# Altium project SensWear-V1R2-Debug.PrjPcb (part 2 of 3)
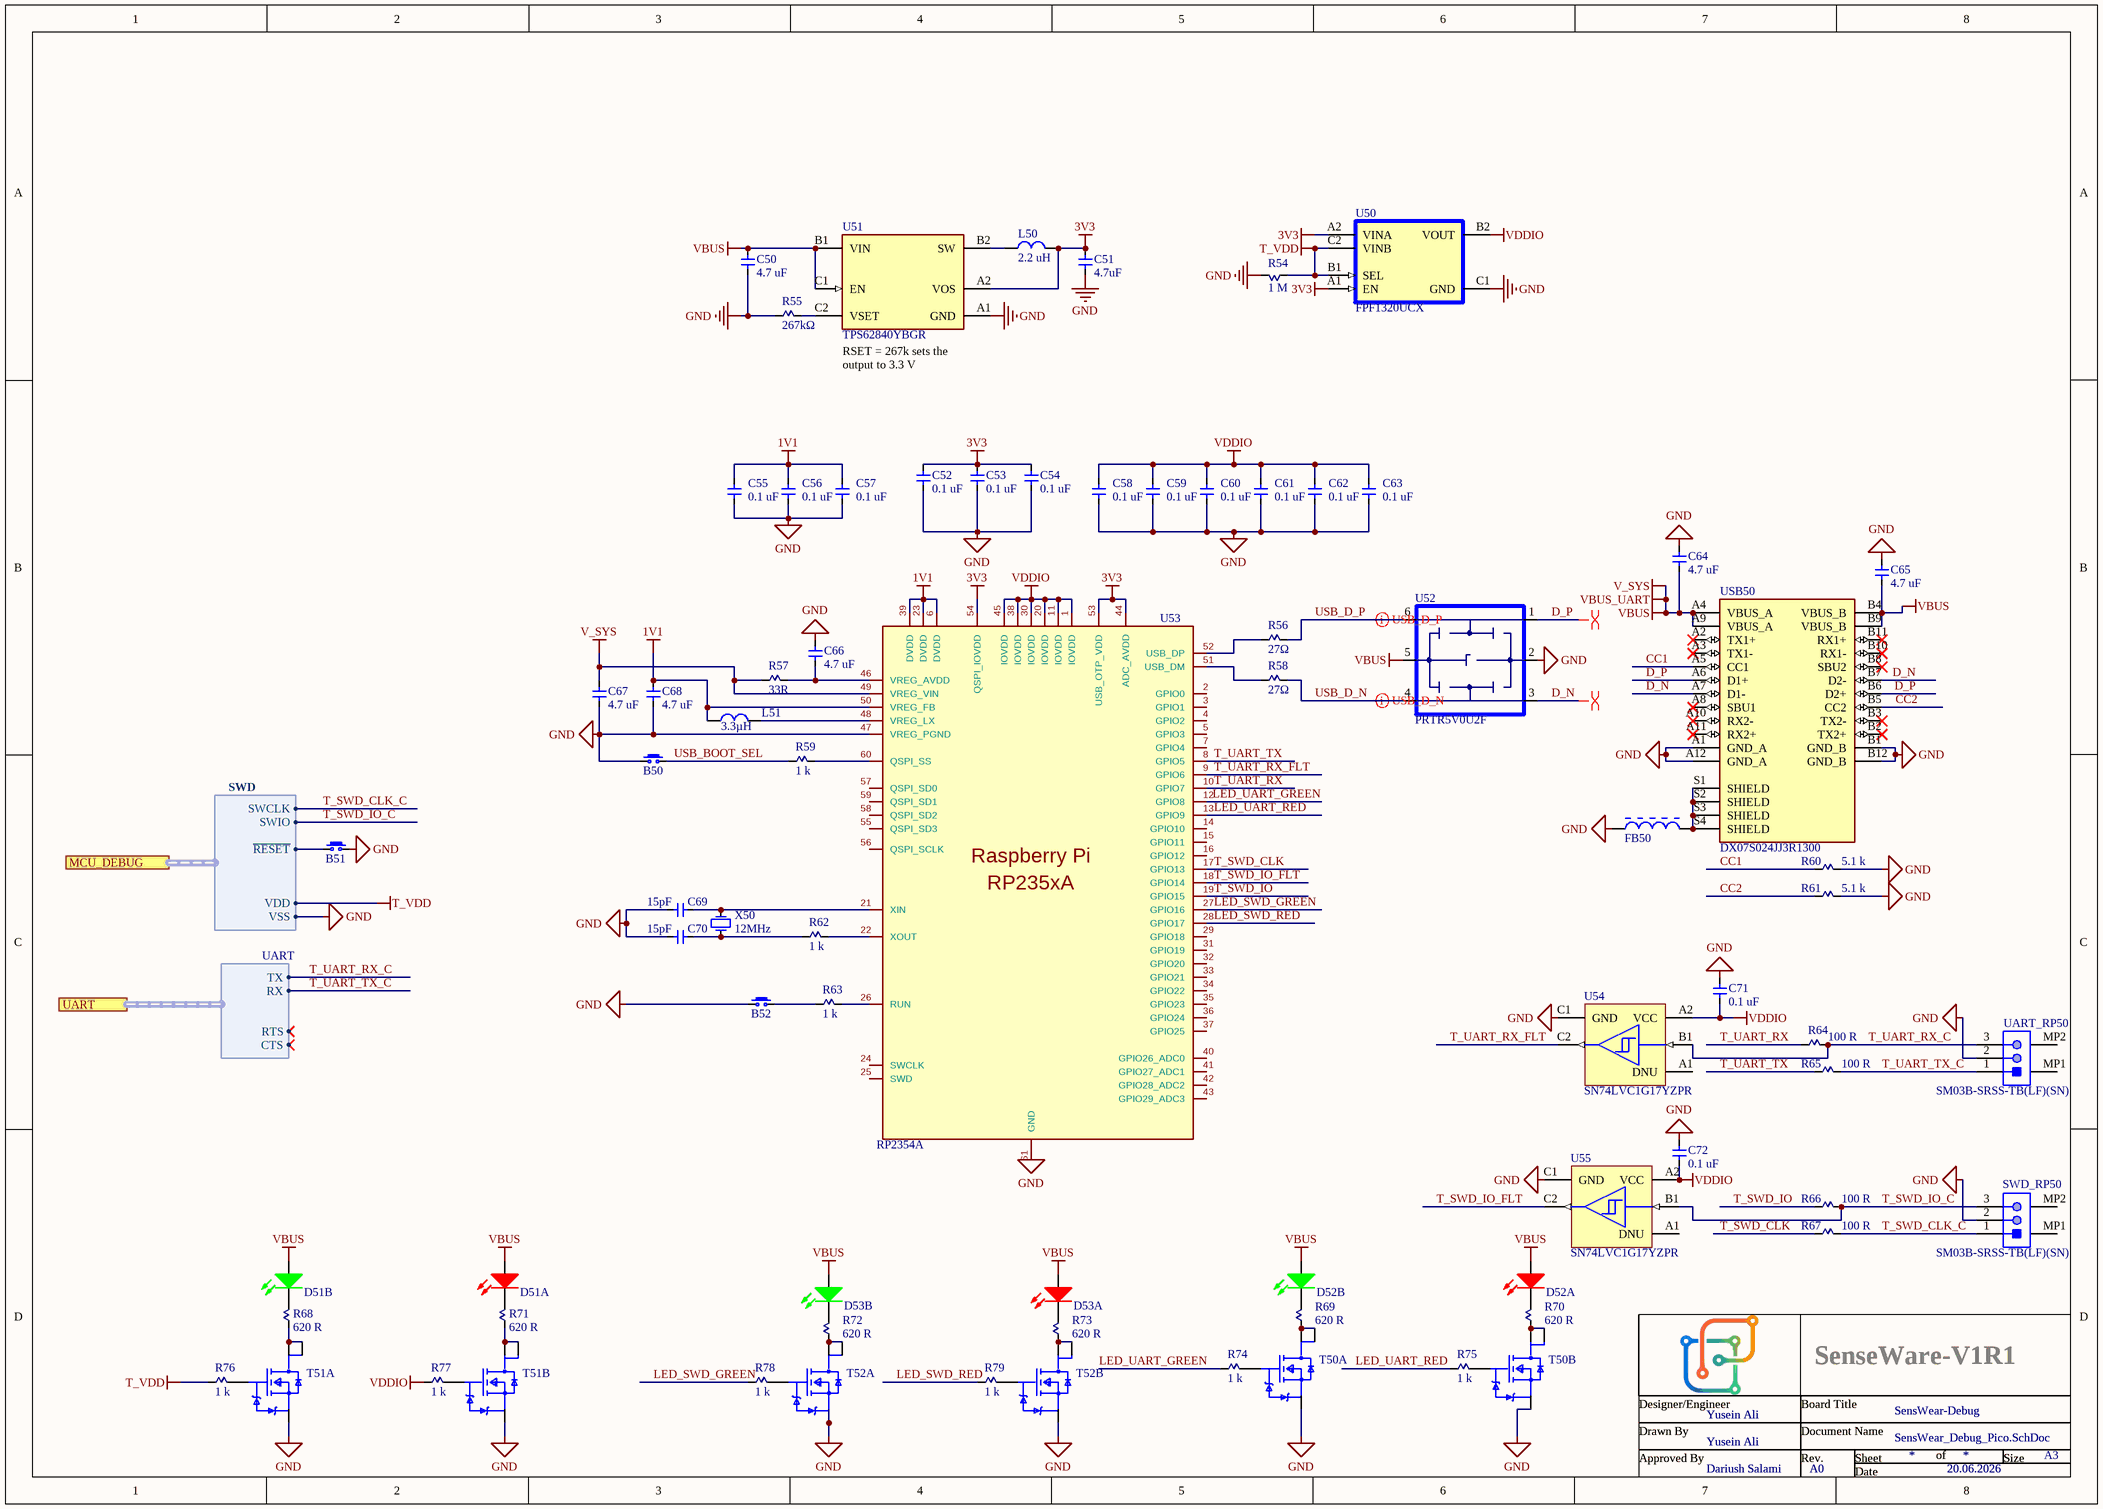
[diagram p3: SensWear_Debug_Pico.SchDoc]

## Sheet SensWear_Debug_Pico.SchDoc (continued)
### Library data of the parts
B50-B52 = B3U-1000P: SWITCH TACTILE SPST-NO 0.05A 12V; Manufacturer: Omron Electronics Inc-EMC Div; Switch Function: Off-Mom; Contact Rating @ Voltage: 0.05A @ 12VDC; Actuator Type: Standard; Actuator Height off PCB, from Pins: 1.60mm; Actuator Orientation: Top Actuated; Outline: 3.00mm x 2.50mm; Illumination: Non-Illuminated; Operating Force: 153gf; Ingress Protection: Dust Proof; Switch Travel: 0.15mm; Mechanical Life: 200,000 Cycles; Supplier 1: Digi-Key; Manufacturer Part Number: B3U-1000P; RoHS: RoHS Compliant; Category: Switches; Stock 1: 66079; Pricing 1: 1=0.93, 10=0.898, 25=0.8468, 50=0.745, 100=0.6774, 250=0.64348, 500=0.62656, 1000=0.49108 (GBP); Packaging: Digi-Reel®; Part Status: Active; Circuit: SPST-NO; Mounting Type: Surface Mount; Termination Style: SMD (SMT) Tab; Illumination Voltage (Nominal): -; Illumination Type, Color: -; Features: -; Actuator Material: -; Operating Temperature: -25°C ~ 70°C; ComponentLink1URL: http://www.omron.com/ecb/products/pdf/en-b3u.pdf; ComponentLink1Description: http://www.omron.com/ecb/products/pdf/en-b3u.pdf; Supplier Part Number 1: SW1020DKR-ND
C50 C64 C65 = GRM188R61A475KE15D: CAP CER 4.7UF 10V X5R 0603; Manufacturer: Murata Electronics North America; Tolerance: ±10%; Capacitance: 4.7µF; Manufacturer Part Number: GRM188R61A475KE15D; RoHS: RoHS Compliant; Category: Capacitors; Packaging: Digi-Reel®; Value: 4.7 uF; ComponentLink1URL: http://www.murata.com/~/media/webrenewal/support/library/catalog/products/capacitor/mlcc/c02e.pdf; ComponentLink1Description: http://www.murata.com/~/media/webrenewal/support/library/catalog/products/capacitor/mlcc/c02e.pdf; Supplier 1: Digi-Key; Supplier Part Number 1: 490-10477-6-ND; Stock 1: 101035; Pricing 1: 1=0.1, 10=0.068, 50=0.0392, 100=0.0323, 250=0.0272, 500=0.0228, 1000=0.0187 (GBP); Part Status: Active; Voltage - Rated: 10V; Temperature Coefficient: X5R; Mounting Type: Surface Mount, MLCC; Operating Temperature: -55°C ~ 85°C; Applications: General Purpose; Ratings: -; Package / Case: 0603 (1608 Metric); Size / Dimension: 0.063" L x 0.031" W (1.60mm x 0.80mm); Height - Seated (Max): -; Thickness (Max): 0.039" (1.00mm); Lead Spacing: -; Features: Derating Recommended; Lead Style: -
C51 = GRM155R61A475MEAAD: Multilayer Ceramic Capacitor, 4.7 uF, 10 V, ± 20%, X5R, 0402 [1005 Metric]; Manufacturer: Murata; Voltage Rating: 10V; Dielectric: 1537DielectricType; Material: 4241ConductorMaterial; Manufacturer Part Number: GRM155R61A475MEAAD; RoHS: Yes; Category: Ceramic Capacitors; Stock: 930000; Pricing: 10000=0,0187, 50000=0,0159, 100000=0,0132 (USD); Mounting Technology: Surface Mount; Case/Package: 0402; Case Code (Metric): 1005; Case Code (Imperial): 0402; Min Operating Temperature: -55°C; Max Operating Temperature: 85°C; Packaging: Tape and Reel; Value: 4.7uF; Tolerance: 20%; Series: GRM; Length: 1mm; Width: 500um; Thickness: 500um; RoHS Compliant: Yes; ComponentLink1URL: http://www.farnell.com/datasheets/2189109.pdf?src-supplier=Farnell; ComponentLink1Description: http://www.farnell.com/datasheets/2189109.pdf?src-supplier=Farnell; ComponentLink2URL: http://www.farnell.com/datasheets/2189109.pdf?src-supplier=Newark; ComponentLink2Description: http://www.farnell.com/datasheets/2189109.pdf?src-supplier=Newark; Supplier 1: Mouser; Supplier Part Number 1: 81-GRM155R61A475MEAD; Supplier 2: Farnell; Supplier Part Number 2: 3581674; Voltage Rating (DC): 10V; Height: 650um; ComponentLink3URL: http://www.farnell.com/datasheets/2189109.pdf?src-supplier=Element14; ComponentLink3Description: http://www.farnell.com/datasheets/2189109.pdf?src-supplier=Element14; ComponentLink4URL: http://datasheet.octopart.com/GRM155R61A475MEAAD-Murata-datasheet-68589269.pdf?src-supplier=Distrelec; ComponentLink4Description: http://datasheet.octopart.com/GRM155R61A475MEAAD-Murata-datasheet-68589269.pdf?src-supplier=Distrelec; ComponentLink5URL: http://datasheet.octopart.com/GRM155R61A475MEAAD-Murata-datasheet-68589269.pdf?src-supplier=Farnell; ComponentLink5Description: http://datasheet.octopart.com/GRM155R61A475MEAAD-Murata-datasheet-68589269.pdf?src-supplier=Farnell; ComponentLink6URL: https://search.murata.co.jp/Ceramy/image/img/A01X/G101/ENG/GRM155R61A475MEAA-01.pdf?src-supplier=Digi-Key; ComponentLink6Description: https://search.murata.co.jp/Ceramy/image/img/A01X/G101/ENG/GRM155R61A475MEAA-01.pdf?src-supplier=Digi-Key; ComponentLink7URL: http://datasheet.octopart.com/GRM155R61A475MEAAD-Murata-datasheet-68589269.pdf?src-supplier=Future+Electronics; ComponentLink7Description: http://datasheet.octopart.com/GRM155R61A475MEAAD-Murata-datasheet-68589269.pdf?src-supplier=Future+Electronics; ComponentLink8URL: https://datasheet.octopart.com/GRM155R61A475MEAAD-Murata-datasheet-68589269.pdf?src-supplier=Newark; ComponentLink8Description: https://datasheet.octopart.com/GRM155R61A475MEAAD-Murata-datasheet-68589269.pdf?src-supplier=Newark; ComponentLink9URL: http://datasheet.octopart.com/GRM155R61A475MEAAD-Murata-datasheet-68589269.pdf?src-supplier=Verical; ComponentLink9Description: http://datasheet.octopart.com/GRM155R61A475MEAAD-Murata-datasheet-68589269.pdf?src-supplier=Verical; ComponentLink10URL: https://datasheet.octopart.com/GRM155R61A475MEAAD-Murata-datasheet-165579666.pdf?src-supplier=TME; ComponentLink10Description: https://datasheet.octopart.com/GRM155R61A475MEAAD-Murata-datasheet-165579666.pdf?src-supplier=TME; ComponentLink11URL: http://datasheet.octopart.com/GRM155R61A475MEAAD-Murata-datasheet-68589269.pdf?src-supplier=Quest; ComponentLink11Description: http://datasheet.octopart.com/GRM155R61A475MEAAD-Murata-datasheet-68589269.pdf?src-supplier=Quest; ComponentLink12URL: http://datasheet.octopart.com/GRM155R61A475MEAAD-Murata-datasheet-68589269.pdf?src-supplier=TTI; ComponentLink12Description: http://datasheet.octopart.com/GRM155R61A475MEAAD-Murata-datasheet-68589269.pdf?src-supplier=TTI; ComponentLink13URL: http://datasheet.octopart.com/GRM155R61A475MEAAD-Murata-datasheet-68589269.pdf?src-supplier=NAC+Semi; ComponentLink13Description: http://datasheet.octopart.com/GRM155R61A475MEAAD-Murata-datasheet-68589269.pdf?src-supplier=NAC+Semi
C52-C63 C71 C72 = GRM155R61A104KA01D: CAP CER 0.1UF 10V X5R 0402; Manufacturer: Murata Electronics North America; Capacitance: 0.10µF; Tolerance: ±10%; Supplier 1: Digi-Key; Manufacturer Part Number: GRM155R61A104KA01D; RoHS: RoHS Compliant; Category: Capacitors; Stock 1: 7731132; Pricing 1: 1=0.1, 10=0.012, 50=0.0066, 100=0.0055, 250=0.00452, 500=0.00386, 1000=0.003, 5000=0.0025 (USD); Packaging: Digi-Reel®; Part Status: Active; Voltage - Rated: 10V; Temperature Coefficient: X5R; Operating Temperature: -55°C ~ 85°C; Features: -; Ratings: -; Applications: General Purpose; Mounting Type: Surface Mount, MLCC; Package / Case: 0402 (1005 Metric); Size / Dimension: 0.039" L x 0.020" W (1.00mm x 0.50mm); Height - Seated (Max): -; Thickness (Max): 0.022" (0.55mm); Lead Spacing: -; Lead Style: -; ComponentLink1URL: http://www.murata.com/~/media/webrenewal/support/library/catalog/products/capacitor/mlcc/c02e.ashx; ComponentLink1Description: http://www.murata.com/~/media/webrenewal/support/library/catalog/products/capacitor/mlcc/c02e.ashx; Supplier Part Number 1: 490-1318-6-ND; Value: 0.1 uF
C66-C68 = GRM188R61A475KE15D: CAP CER 4.7UF 10V X5R 0603; Manufacturer: Murata Electronics North America; Capacitance: 4.7µF; Tolerance: ±10%; Supplier 1: Digi-Key; Manufacturer Part Number: GRM188R61A475KE15D; RoHS: RoHS Compliant; Category: Capacitors; Stock 1: 101035; Pricing 1: 1=0.1, 10=0.068, 50=0.0392, 100=0.0323, 250=0.0272, 500=0.0228, 1000=0.0187 (GBP); Packaging: Digi-Reel®; Part Status: Active; Voltage - Rated: 10V; Temperature Coefficient: X5R; Mounting Type: Surface Mount, MLCC; Operating Temperature: -55°C ~ 85°C; Applications: General Purpose; Ratings: -; Package / Case: 0603 (1608 Metric); Size / Dimension: 0.063" L x 0.031" W (1.60mm x 0.80mm); Height - Seated (Max): -; Thickness (Max): 0.039" (1.00mm); Lead Spacing: -; Features: Derating Recommended; Lead Style: -; ComponentLink1URL: http://www.murata.com/~/media/webrenewal/support/library/catalog/products/capacitor/mlcc/c02e.pdf; ComponentLink1Description: http://www.murata.com/~/media/webrenewal/support/library/catalog/products/capacitor/mlcc/c02e.pdf; Supplier Part Number 1: 490-10477-6-ND; Value: 4.7 uF
C69 C70 = GRM1555C1E150JA01D: CAP CER 15 pF 25V C0G 0402; Manufacturer: Murata; Manufacturer Lifecycle Status: NRND; Dielectric Material: Ceramic; Tolerance: 5%; Supplier: Future Electronics; Supplier Part Number: GRM1555C1E150JA01D; Manufacturer Part Number: GRM1555C1E150JA01D; RoHS: Compliant; Category: Ceramic Capacitors; Stock: 110000; Pricing: 10000=0.0053, 30000=0.0051, 50000=0.005, 150000=0.0049, 250000=0.0047 (USD); Value: 15pF; Case/Package: 0402; Case Code (Imperial): 0402; Case Code (Metric): 1005; Depth: 500µm; Dielectric: C0G; Height: 500µm; Lead Free: Lead Free; Length: 1mm; Lifecycle Status: NRND; Material: Ceramic; Max Operating Temperature: 125°C; Min Operating Temperature: -55°C; Mounting Technology: Surface Mount; Number of Terminals: 2; Radiation Hardening: No; REACH SVHC: Yes; Schedule B: 8532240020, 8532240020|8532240020, 8532240020|8532240020|8532240020, 8532240020|8532240020|8532240020|8532240020; Termination: SMD/SMT; Thickness: 500µm; Voltage Rating: 25V; Voltage Rating (DC): 25V; Width: 500µm; ComponentLink1URL: https://datasheet.octopart.com:443/GRM1555C1E150JA01D-Murata-datasheet-14399184.pdf?src-supplier=Future+Electronics; ComponentLink1Description: https://datasheet.octopart.com:443/GRM1555C1E150JA01D-Murata-datasheet-14399184.pdf?src-supplier=Future+Electronics; ComponentLink2URL: https://datasheet.octopart.com:443/GRM1555C1E150JA01D-Murata-datasheet-22122223.pdf?src-supplier=Future+Electronics; ComponentLink2Description: https://datasheet.octopart.com:443/GRM1555C1E150JA01D-Murata-datasheet-22122223.pdf?src-supplier=Future+Electronics; ComponentLink3URL: https://datasheet.octopart.com:443/GRM1555C1E150JA01D-Murata-datasheet-141274211.pdf?src-supplier=Ciiva; ComponentLink3Description: https://datasheet.octopart.com:443/GRM1555C1E150JA01D-Murata-datasheet-141274211.pdf?src-supplier=Ciiva; ComponentLink4URL: https://datasheet.octopart.com:443/GRM1555C1E150JA01D-Murata-datasheet-140679615.pdf?src-supplier=Ciiva; ComponentLink4Description: https://datasheet.octopart.com:443/GRM1555C1E150JA01D-Murata-datasheet-140679615.pdf?src-supplier=Ciiva; ComponentLink5URL: https://datasheet.octopart.com:443/GRM1555C1E150JA01D-Murata-datasheet-138739066.pdf?src-supplier=Ciiva; ComponentLink5Description: https://datasheet.octopart.com:443/GRM1555C1E150JA01D-Murata-datasheet-138739066.pdf?src-supplier=Ciiva; ComponentLink6URL: https://datasheet.octopart.com/GRM1555C1E150JA01D-Murata-datasheet-12515295.pdf; ComponentLink6Description: https://datasheet.octopart.com/GRM1555C1E150JA01D-Murata-datasheet-12515295.pdf; ComponentLink7URL: https://datasheet.octopart.com/GRM1555C1E150JA01D-Murata-datasheet-12510076.pdf; ComponentLink7Description: https://datasheet.octopart.com/GRM1555C1E150JA01D-Murata-datasheet-12510076.pdf; ComponentLink8URL: https://datasheet.octopart.com/GRM1555C1E150JA01D-Murata-datasheet-11978611.pdf; ComponentLink8Description: https://datasheet.octopart.com/GRM1555C1E150JA01D-Murata-datasheet-11978611.pdf; ComponentLink9URL: https://datasheet.octopart.com/GRM1555C1E150JA01D-Murata-datasheet-10025737.pdf; ComponentLink9Description: https://datasheet.octopart.com/GRM1555C1E150JA01D-Murata-datasheet-10025737.pdf; ComponentLink10URL: https://datasheet.octopart.com/GRM1555C1E150JA01D-Murata-datasheet-8819587.pdf; ComponentLink10Description: https://datasheet.octopart.com/GRM1555C1E150JA01D-Murata-datasheet-8819587.pdf; ComponentLink11URL: http://sigma.octopart.com:80/reach_statement/Murata-company-16.pdf?src-supplier=Compliance+Statements; ComponentLink11Description: http://sigma.octopart.com:80/reach_statement/Murata-company-16.pdf?src-supplier=Compliance+Statements
D51-D53 = LTST-C155KGJRKT: LED GREEN/RED CLEAR CHIP SMD; Manufacturer: Vishay Lite-On; Color: Green,Red; Lens Color: Colorless; Viewing Angle: 130°; Reverse Voltage: 5V; Wavelength: 639nm; Number of LEDs: 2; Forward Current: 30mA; Forward Voltage: 2V; Power Rating: 75mW; Luminous Intensity: 45mcd; Lens Style: Diffused,Colorless,Rectangular,Clear; Dominant Wavelength: 631nm; Test Current: 20mA; Supplier 1: Digi-Key; Manufacturer Part Number: LTST-C155KGJRKT; RoHS: Yes; Category: LEDs; Stock 1: 123598; Pricing 1: 1=0.43000, 10=0.28000, 100=0.18670, 500=0.12912, 1000=0.10760 (USD); Packaging: Tape and Reel; Lens Transparency: Clear; ComponentLink1URL: https://datasheet.ciiva.com/11774/0900766b80dc0273-11774195.pdf?src-supplier=RSComponents; ComponentLink1Description: https://datasheet.ciiva.com/11774/0900766b80dc0273-11774195.pdf?src-supplier=RSComponents; Supplier Part Number 1: 160-1409-1-ND; Mount: Surface Mount; Case/Package: 1210; Number of Pins: 4; Case Code (Imperial): 1210; Case Code (Metric): 3225; Min Operating Temperature: -55°C; Max Operating Temperature: 85°C; Package Quantity: 1; Illumination Color: Green,Red; Number of Elements: 2; Power Dissipation: 75mW; Max Power Dissipation: 75mW; Length: 2.7mm; Width: 2.7mm; Height: 1.1mm; Depth: 3.2mm; Radiation Hardening: No; Lead Free: Lead Free; ComponentLink2URL: https://datasheet.ciiva.com/15117/getdatasheetpartid-103641-15117440.pdf?src-supplier=Verical; ComponentLink2Description: https://datasheet.ciiva.com/15117/getdatasheetpartid-103641-15117440.pdf?src-supplier=Verical; ComponentLink3URL: https://datasheet.ciiva.com/16366/lite-on20ltst-c155kgjrkt-16366147.pdf?src-supplier=Future+Electronics; ComponentLink3Description: https://datasheet.ciiva.com/16366/lite-on20ltst-c155kgjrkt-16366147.pdf?src-supplier=Future+Electronics; ComponentLink4URL: https://datasheet.ciiva.com/27051/1260277-27051786.pdf?src-supplier=Jameco; ComponentLink4Description: https://datasheet.ciiva.com/27051/1260277-27051786.pdf?src-supplier=Jameco; ComponentLink5URL: https://datasheet.ciiva.com/2110/s-110-ltst-c155kgjrkt-2110800.pdf?src-supplier=Digi-Key; ComponentLink5Description: https://datasheet.ciiva.com/2110/s-110-ltst-c155kgjrkt-2110800.pdf?src-supplier=Digi-Key; ComponentLink6URL: https://datasheet.ciiva.com/2110/s-110-ltst-c155kgjrkt-2110801.pdf?src-supplier=Digi-Key; ComponentLink6Description: https://datasheet.ciiva.com/2110/s-110-ltst-c155kgjrkt-2110801.pdf?src-supplier=Digi-Key
FB50 = BLM15AG601SN1D: FERRITE BEAD 600 OHM 0402 1LN; Manufacturer: Murata; Material: Steel,Ferrite; Max DC Current: 300mA; DC Resistance (DCR): 520mR; Impedance: 600R; Test Frequency: 100MHz; Number of Lines: 1; Tolerance: 25%; Shielding: Unshielded; Supplier 1: Digi-Key; Supplier Part Number 1: 490-1006-1-ND; Manufacturer Part Number: BLM15AG601SN1D; RoHS: Yes; Category: Inductors; Stock 1: 436370; Pricing 1: 1=0.10000, 10=0.07600, 25=0.06960, 50=0.06260, 100=0.04590, 250=0.03336, 500=0.03058, 1000=0.02641, 5000=0.02085 (USD); Case/Package: 0402; Number of Pins: 2; Case Code (Metric): 1005; Case Code (Imperial): 0402; Core Material: Ferrite; Min Operating Temperature: -55°C; Max Operating Temperature: 125°C; Package Quantity: 10000; Packaging: Tape and Reel; Current Rating: 300mA; Termination: SMD/SMT; Max Current Rating: 300mA; Number of Circuits: 1; DC Current: 300mA; Frequency: 100MHz; Length: 1mm; Width: 0.5mm; Height: 0.5mm; Depth: 0.55mm; Radiation Hardening: No; REACH SVHC: No SVHC; Lead Free: Lead Free; Military Standard: Not; ComponentLink1URL: https://datasheet.ciiva.com/11799/0900766b811b5866-11799226.pdf?src-supplier=RSComponents; ComponentLink1Description: https://datasheet.ciiva.com/11799/0900766b811b5866-11799226.pdf?src-supplier=RSComponents; ComponentLink2URL: https://datasheet.ciiva.com/29347/442210-da-01-en-chip-drossel-0402-600r-300ma-1-0x0-5mm-29347879.pdf?src-supplier=Conrad; ComponentLink2Description: https://datasheet.ciiva.com/29347/442210-da-01-en-chip-drossel-0402-600r-300ma-1-0x0-5mm-29347879.pdf?src-supplier=Conrad; ComponentLink3URL: https://datasheet.ciiva.com/41449/001172163-da-01-en-drossel-0402-600r-1-0x0-5mm-10000st-41449450.pdf?src-supplier=Conrad; ComponentLink3Description: https://datasheet.ciiva.com/41449/001172163-da-01-en-drossel-0402-600r-1-0x0-5mm-10000st-41449450.pdf?src-supplier=Conrad; ComponentLink4URL: https://datasheet.ciiva.com/6212/l0110s0100blm15ag-sn-6212565.pdf?src-supplier=Digi-Key; ComponentLink4Description: https://datasheet.ciiva.com/6212/l0110s0100blm15ag-sn-6212565.pdf?src-supplier=Digi-Key; ComponentLink5URL: https://datasheet.ciiva.com/6212/l0110s0100blm15ag-sn-6212519.pdf?src-supplier=Digi-Key; ComponentLink5Description: https://datasheet.ciiva.com/6212/l0110s0100blm15ag-sn-6212519.pdf?src-supplier=Digi-Key; ComponentLink6URL: https://datasheet.ciiva.com/1466/5144-1466744.pdf?src-supplier=Element14; ComponentLink6Description: https://datasheet.ciiva.com/1466/5144-1466744.pdf?src-supplier=Element14; ComponentLink7URL: https://datasheet.ciiva.com/6212/l0110s0100blm15ag-sn-6212520.pdf?src-supplier=Digi-Key; ComponentLink7Description: https://datasheet.ciiva.com/6212/l0110s0100blm15ag-sn-6212520.pdf?src-supplier=Digi-Key; ComponentLink8URL: https://datasheet.ciiva.com/1466/5144-1466745.pdf?src-supplier=Element14; ComponentLink8Description: https://datasheet.ciiva.com/1466/5144-1466745.pdf?src-supplier=Element14; ComponentLink9URL: https://datasheet.ciiva.com/8510/l0110s0100blm15ag-sn-8510909.pdf?src-supplier=Avnet; ComponentLink9Description: https://datasheet.ciiva.com/8510/l0110s0100blm15ag-sn-8510909.pdf?src-supplier=Avnet; ComponentLink10URL: https://datasheet.ciiva.com/14122/blm-series-eng-tds-14122894.pdf?src-supplier=Distrelec; ComponentLink10Description: https://datasheet.ciiva.com/14122/blm-series-eng-tds-14122894.pdf?src-supplier=Distrelec; ComponentLink11URL: https://datasheet.ciiva.com/8084/l0110s0100blm15ag-sn-8084271.pdf?src-supplier=Avnet; ComponentLink11Description: https://datasheet.ciiva.com/8084/l0110s0100blm15ag-sn-8084271.pdf?src-supplier=Avnet
L50 = DFE201612E-2R2M=P2: Inductor Power Shielded Wirewound 2.2uH 20% 1MHz Metal 1.8A 0.116Ohm DCR 0806 T/R; Manufacturer: Murata; Saturation Current: 2.4A; ESR: 116mR; Supplier: Mouser; Supplier Part Number: 81-DFE201612E-2R2MP2; Manufacturer Part Number: DFE201612E-2R2M=P2; RoHS: Yes; Category: Fixed Inductors; Stock: 102000; Pricing: 3000=0,0929 (USD); ComponentLink1URL: http://www.farnell.com/datasheets/2339714.pdf?src-supplier=Farnell; ComponentLink1Description: http://www.farnell.com/datasheets/2339714.pdf?src-supplier=Farnell; ComponentLink2URL: https://search.murata.co.jp/Ceramy/image/img/P02/J(E)TE243A-0006.pdf?src-supplier=Digi-Key; ComponentLink2Description: https://search.murata.co.jp/Ceramy/image/img/P02/J(E)TE243A-0006.pdf?src-supplier=Digi-Key; ComponentLink3URL: http://www.farnell.com/datasheets/2339714.pdf?src-supplier=Newark; ComponentLink3Description: http://www.farnell.com/datasheets/2339714.pdf?src-supplier=Newark; ComponentLink4URL: https://datasheet.octopart.com/DFE201612E-2R2M%3DP2-Murata-datasheet-150582460.pdf?src-supplier=Arrow.cn; ComponentLink4Description: https://datasheet.octopart.com/DFE201612E-2R2M%3DP2-Murata-datasheet-150582460.pdf?src-supplier=Arrow.cn; Supplier 1: Mouser; Supplier Part Number 1: 81-DFE201612E-2R2MP2; Value: 2.2 uH; Min Operating Temperature: -40°C; Max Operating Temperature: 125°C; Current Rating: 1.8A; Inductance Tolerance: 20%; Packaging: 13Packaging; RMS Current (Irms): 1.8A; Test Frequency: 1MHz; Height: 1.2mm; ComponentLink5URL: https://search.murata.co.jp/Ceramy/image/img/P02/J(E)TE243A-0006.pdf?src-supplier=Digikey; ComponentLink5Description: https://search.murata.co.jp/Ceramy/image/img/P02/J(E)TE243A-0006.pdf?src-supplier=Digikey; Supplier 2: Digikey; Supplier Part Number 2: 490-DFE201612E-2R2M=P2CT-ND; Supplier 3: Digikey; Supplier Part Number 3: 490-DFE201612E-2R2M=P2DKR-ND
L51 = AOTA-B201610S3R3-101-T: General Purpose Inductor, 3.3uH, 20%, 1 Element, SMD, 0806; Manufacturer: Abracon; DC Resistance (DCR): 140mΩ; Max Current Rating: 2.1A; Number of Circuits: 1; Self Resonant Frequency: 21MHz; Shielding: Shielded; Test Frequency: 1MHz; Supplier: Future Electronics; Supplier Part Number: AOTA-B201610S3R3-101-T; Manufacturer Part Number: AOTA-B201610S3R3-101-T; RoHS: Compliant; Category: Fixed Inductors; Stock: 9000; Pricing: 3000=0.0966, 6000=0.095, 9000=0.094, 12000=0.0933, 15000=0.0911 (USD); Case/Package: 0806; Export Control Classification Number (ECCN) Code: EAR99; Height: 1mm; Harmonized Tariff Schedule (HTS) Code: 8504.50.80.00; Value: 3.3µH; Introduction Date: 2024-09-16; Length: 2mm; Lifecycle Status: Production; Max Operating Temperature: 125°C; Min Operating Temperature: -40°C; Number of Terminals: 2; Tolerance: 20%; Width: 1.6mm; ComponentLink1URL: https://datasheet.octopart.com:443/AOTA-B201610S3R3-101-T-Abracon-datasheet-188850378.pdf?src-supplier=HQonline; ComponentLink1Description: https://datasheet.octopart.com:443/AOTA-B201610S3R3-101-T-Abracon-datasheet-188850378.pdf?src-supplier=HQonline; ComponentLink2URL: http://sigma.octopart.com:80/conflict_mineral_statement/Abracon-company-27.pdf?src-supplier=Compliance+Statements; ComponentLink2Description: http://sigma.octopart.com:80/conflict_mineral_statement/Abracon-company-27.pdf?src-supplier=Compliance+Statements
R54 = ERJ-2RKF1004X: RES SMD 1M OHM 1% 1/10W 0402; Manufacturer: Panasonic Electronic Components; Power (Watts): 0.1W, 1/10W; Temperature Coefficient: ±100ppm/°C; Supplier 1: Digi-Key; Manufacturer Part Number: ERJ-2RKF1004X; RoHS: RoHS Compliant; Category: Resistors; Stock 1: 1590446; Pricing 1: 1=0.1, 10=0.025, 25=0.018, 50=0.0136, 100=0.01, 250=0.00764, 500=0.00612, 1000=0.00451, 5000=0.00323 (USD); Packaging: Digi-Reel®; Part Status: Active; Resistance (Ohms): 1M; Tolerance: ±1%; Composition: Thick Film; Features: Automotive AEC-Q200; Operating Temperature: -55°C ~ 155°C; Package / Case: 0402 (1005 Metric); Supplier Device Package: 0402; Size / Dimension: 0.039" L x 0.020" W (1.00mm x 0.50mm); Height - Seated (Max): 0.016" (0.40mm); Number of Terminations: 2; Failure Rate: -; ComponentLink1URL: https://industrial.panasonic.com/cdbs/www-data/pdf/RDA0000/AOA0000C283.pdf; ComponentLink1Description: https://industrial.panasonic.com/cdbs/www-data/pdf/RDA0000/AOA0000C283.pdf; Supplier Part Number 1: P1.00MLDKR-ND; Value: 1 M
R55 = ERJ-2RKF2673X: Res Thick Film 0402 267K Ohm 1% 1/10W ±100ppm/°C Molded SMD Punched Carrier T/R; Manufacturer: Panasonic; Manufacturer Lifecycle Status: ACTIVE; Part Series: Precision Thick Film Chip Resistors; Max Power Dissipation: 100mW; Voltage Rating: 50V; Supplier: Future Electronics; Supplier Part Number: ERJ2RKF2673X; Manufacturer Part Number: ERJ-2RKF2673X; RoHS: Compliant; Category: Chip SMD Resistors; Stock: 90000; Pricing: 10000=0.0035, 40000=0.0034, 150000=0.0033, 250000=0.0032, 500000=0.0031 (USD); ComponentLink1URL: https://datasheet.octopart.com:443/ERJ-2RKF2673X-Panasonic-datasheet-82288794.pdf?src-supplier=Panasonic; ComponentLink1Description: https://datasheet.octopart.com:443/ERJ-2RKF2673X-Panasonic-datasheet-82288794.pdf?src-supplier=Panasonic; Value: 267kΩ; Case/Package: 0402; Case Code (Imperial): 0402; China RoHS: Non-Compliant; Composition: Thick Film; Contact Plating: Tin; Country of Origin: Japan, Mainland China; Depth: 500µm; Export Control Classification Number (ECCN) Code: EAR99; Features: Automotive AEC-Q200; Height: 350µm; Harmonized Tariff Schedule (HTS) Code: 8533.21.00.30; Introduction Date: 2004-02-02; Lead Free: Lead Free; Length: 1mm; Lifecycle Status: Production; Max Operating Temperature: 155°C; Military Standard: Not; Min Operating Temperature: -55°C; Mounting Technology: Surface Mount; Number of Terminals: 2; Number of Terminations: 2; Power Dissipation: 100mW; Power Rating: 100mW; Ratings: AEC-Q200; REACH SVHC: Yes; Schedule B: 8533210045, 8533210045|8533210045|8533210045|8533210045|8533210045; Temperature Coefficient: 100ppm/°C; Termination: SMD/SMT; Tolerance: 1%; Voltage Rating (DC): 50V; Width: 500µm; Working Voltage: 50V; ComponentLink2URL: https://datasheet.octopart.com:443/ERJ-2RKF2673X-Panasonic-datasheet-48891056.pdf?src-supplier=Newark; ComponentLink2Description: https://datasheet.octopart.com:443/ERJ-2RKF2673X-Panasonic-datasheet-48891056.pdf?src-supplier=Newark; ComponentLink3URL: https://datasheet.octopart.com:443/ERJ-2RKF2673X-Panasonic-datasheet-13266541.pdf?src-supplier=Newark; ComponentLink3Description: https://datasheet.octopart.com:443/ERJ-2RKF2673X-Panasonic-datasheet-13266541.pdf?src-supplier=Newark; ComponentLink4URL: https://datasheet.octopart.com:443/ERJ-2RKF2673X-Panasonic-datasheet-33006990.pdf?src-supplier=Newark; ComponentLink4Description: https://datasheet.octopart.com:443/ERJ-2RKF2673X-Panasonic-datasheet-33006990.pdf?src-supplier=Newark; ComponentLink5URL: https://datasheet.octopart.com:443/ERJ-2RKF2673X-Panasonic---ECG-datasheet-21211697.pdf?src-supplier=Newark; ComponentLink5Description: https://datasheet.octopart.com:443/ERJ-2RKF2673X-Panasonic---ECG-datasheet-21211697.pdf?src-supplier=Newark; ComponentLink6URL: https://datasheet.octopart.com:443/ERJ-2RKF2673X-Panasonic-datasheet-136608610.pdf?src-supplier=Farnell; ComponentLink6Description: https://datasheet.octopart.com:443/ERJ-2RKF2673X-Panasonic-datasheet-136608610.pdf?src-supplier=Farnell; ComponentLink7URL: https://datasheet.octopart.com:443/ERJ-2RKF2673X-Panasonic---ECG-datasheet-15994758.pdf?src-supplier=Farnell; ComponentLink7Description: https://datasheet.octopart.com:443/ERJ-2RKF2673X-Panasonic---ECG-datasheet-15994758.pdf?src-supplier=Farnell; ComponentLink8URL: https://datasheet.octopart.com:443/ERJ-2RKF2673X-Panasonic---ECG-datasheet-10025800.pdf?src-supplier=Farnell; ComponentLink8Description: https://datasheet.octopart.com:443/ERJ-2RKF2673X-Panasonic---ECG-datasheet-10025800.pdf?src-supplier=Farnell; ComponentLink9URL: https://datasheet.octopart.com:443/ERJ-2RKF2673X-Panasonic---ECG-datasheet-8853621.pdf?src-supplier=Farnell; ComponentLink9Description: https://datasheet.octopart.com:443/ERJ-2RKF2673X-Panasonic---ECG-datasheet-8853621.pdf?src-supplier=Farnell; ComponentLink10URL: https://datasheet.octopart.com:443/ERJ-2RKF2673X-Panasonic---ECG-datasheet-5313456.pdf?src-supplier=Farnell; ComponentLink10Description: https://datasheet.octopart.com:443/ERJ-2RKF2673X-Panasonic---ECG-datasheet-5313456.pdf?src-supplier=Farnell; ComponentLink11URL: https://datasheet.octopart.com:443/ERJ2RKF2673X-Panasonic-datasheet-164353789.pdf?src-supplier=HQonline; ComponentLink11Description: https://datasheet.octopart.com:443/ERJ2RKF2673X-Panasonic-datasheet-164353789.pdf?src-supplier=HQonline; ComponentLink12URL: https://datasheet.octopart.com:443/ERJ-2RKF2673X-Panasonic-datasheet-154766169.pdf?src-supplier=Master+Electronics; ComponentLink12Description: https://datasheet.octopart.com:443/ERJ-2RKF2673X-Panasonic-datasheet-154766169.pdf?src-supplier=Master+Electronics; ComponentLink13URL: https://datasheet.octopart.com:443/ERJ2RKF2673X-Panasonic-datasheet-188592431.pdf?src-supplier=TME; ComponentLink13Description: https://datasheet.octopart.com:443/ERJ2RKF2673X-Panasonic-datasheet-188592431.pdf?src-supplier=TME; ComponentLink14URL: https://datasheet.octopart.com/ERJ-2RKF2673X-Panasonic-datasheet-78375410.pdf; ComponentLink14Description: https://datasheet.octopart.com/ERJ-2RKF2673X-Panasonic-datasheet-78375410.pdf; ComponentLink15URL: https://datasheet.octopart.com:443/ERJ-2RKF2673X-Panasonic-datasheet-11542829.pdf?src-supplier=Arrow+Electronics; ComponentLink15Description: https://datasheet.octopart.com:443/ERJ-2RKF2673X-Panasonic-datasheet-11542829.pdf?src-supplier=Arrow+Electronics; ComponentLink16URL: https://datasheet.octopart.com:443/ERJ-2RKF2673X-Panasonic-datasheet-118621.pdf?src-supplier=DigiKey; ComponentLink16Description: https://datasheet.octopart.com:443/ERJ-2RKF2673X-Panasonic-datasheet-118621.pdf?src-supplier=DigiKey; ComponentLink17URL: https://datasheet.octopart.com:443/ERJ-2RKF2673X-Panasonic-datasheet-41391857.pdf?src-supplier=Electro+Sonic; ComponentLink17Description: https://datasheet.octopart.com:443/ERJ-2RKF2673X-Panasonic-datasheet-41391857.pdf?src-supplier=Electro+Sonic
R56 R58 = ERJ-2RKF27R0X: Res Thick Film 0402 27 Ohm 1% 0.1W ±100ppm/°C Molded SMD Punched Carrier T/R; Manufacturer: Panasonic; Manufacturer Lifecycle Status: ACTIVE; Part Series: Precision Thick Film Chip Resistors; Max Power Dissipation: 100mW; Voltage Rating: 50V; Supplier: Farnell; Supplier Part Number: ERJ2RKF27R0X; Manufacturer Part Number: ERJ-2RKF27R0X; RoHS: Compliant; Category: Chip SMD Resistors; Stock: 52991; Pricing: 10=0.0163, 100=0.0124, 500=0.0086, 2500=0.0077, 5000=0.0058 (EUR); Case/Package: 0402; Case Code (Imperial): 0402; Case Code (Metric): 1005; China RoHS: Non-Compliant; Composition: Thick Film; Contact Plating: Tin; Depth: 500µm; Features: Automotive AEC-Q200; Height: 350µm; Lead Free: Lead Free; Length: 1mm; Lifecycle Status: Production; Max Operating Temperature: 155°C; Military Standard: Not; Min Operating Temperature: -55°C; Mounting Technology: Surface Mount; Pins: 2; Number of Terminals: 2; Number of Terminations: 2; Packaging: Cut Tape; Power Dissipation: 100mW; Power Rating: 100mW; Radiation Hardening: No; Ratings: AEC-Q200; REACH SVHC: Yes; Value: 27Ω; Schedule B: 8533210045, 8533210045|8533210045|8533210045|8533210045|8533210045; Temperature Coefficient: 100ppm/°C; Termination: SMD/SMT; Tolerance: 1%; Voltage Rating (DC): 50V; Weight: 793.786648µg; Width: 500µm; Working Voltage: 50V; ComponentLink1URL: https://datasheet.octopart.com:443/ERJ-2RKF27R0X-Panasonic-datasheet-82288794.pdf?src-supplier=Panasonic; ComponentLink1Description: https://datasheet.octopart.com:443/ERJ-2RKF27R0X-Panasonic-datasheet-82288794.pdf?src-supplier=Panasonic; ComponentLink2URL: https://datasheet.octopart.com:443/ERJ-2RKF27R0X-Panasonic-datasheet-13266541.pdf?src-supplier=element14+APAC; ComponentLink2Description: https://datasheet.octopart.com:443/ERJ-2RKF27R0X-Panasonic-datasheet-13266541.pdf?src-supplier=element14+APAC; ComponentLink3URL: https://datasheet.octopart.com:443/ERJ2RKF27R0X-Panasonic-datasheet-10025800.pdf?src-supplier=element14+APAC; ComponentLink3Description: https://datasheet.octopart.com:443/ERJ2RKF27R0X-Panasonic-datasheet-10025800.pdf?src-supplier=element14+APAC; ComponentLink4URL: https://datasheet.octopart.com:443/ERJ2RKF27R0X-Panasonic-datasheet-8853621.pdf?src-supplier=element14+APAC; ComponentLink4Description: https://datasheet.octopart.com:443/ERJ2RKF27R0X-Panasonic-datasheet-8853621.pdf?src-supplier=element14+APAC; ComponentLink5URL: https://datasheet.octopart.com:443/ERJ-2RKF27R0X-Panasonic-datasheet-5313456.pdf?src-supplier=element14+APAC; ComponentLink5Description: https://datasheet.octopart.com:443/ERJ-2RKF27R0X-Panasonic-datasheet-5313456.pdf?src-supplier=element14+APAC; ComponentLink6URL: https://datasheet.octopart.com:443/ERJ-2RKF27R0X-Panasonic-datasheet-48891056.pdf?src-supplier=Newark; ComponentLink6Description: https://datasheet.octopart.com:443/ERJ-2RKF27R0X-Panasonic-datasheet-48891056.pdf?src-supplier=Newark; ComponentLink7URL: https://datasheet.octopart.com:443/ERJ-2RKF27R0X.-Panasonic-datasheet-182872238.pdf?src-supplier=Newark; ComponentLink7Description: https://datasheet.octopart.com:443/ERJ-2RKF27R0X.-Panasonic-datasheet-182872238.pdf?src-supplier=Newark; ComponentLink8URL: https://datasheet.octopart.com:443/ERJ-2RKF27R0X-Panasonic-datasheet-154766169.pdf?src-supplier=JRH+Electronics; ComponentLink8Description: https://datasheet.octopart.com:443/ERJ-2RKF27R0X-Panasonic-datasheet-154766169.pdf?src-supplier=JRH+Electronics; ComponentLink9URL: https://datasheet.octopart.com:443/ERJ-2RKF27R0X-Panasonic-datasheet-136608610.pdf?src-supplier=Farnell; ComponentLink9Description: https://datasheet.octopart.com:443/ERJ-2RKF27R0X-Panasonic-datasheet-136608610.pdf?src-supplier=Farnell; ComponentLink10URL: https://datasheet.octopart.com:443/ERJ2RKF27R0X-Panasonic-datasheet-164353789.pdf?src-supplier=HQonline; ComponentLink10Description: https://datasheet.octopart.com:443/ERJ2RKF27R0X-Panasonic-datasheet-164353789.pdf?src-supplier=HQonline; ComponentLink11URL: https://datasheet.octopart.com:443/ERJ2RKF27R0X-Panasonic-datasheet-188592431.pdf?src-supplier=TME; ComponentLink11Description: https://datasheet.octopart.com:443/ERJ2RKF27R0X-Panasonic-datasheet-188592431.pdf?src-supplier=TME; ComponentLink12URL: https://datasheet.octopart.com/ERJ-2RKF27R0X-Panasonic-datasheet-78375410.pdf; ComponentLink12Description: https://datasheet.octopart.com/ERJ-2RKF27R0X-Panasonic-datasheet-78375410.pdf; ComponentLink13URL: https://datasheet.octopart.com:443/ERJ2RKF27R0X-Panasonic-datasheet-11784922.pdf?src-supplier=Arrow+Electronics; ComponentLink13Description: https://datasheet.octopart.com:443/ERJ2RKF27R0X-Panasonic-datasheet-11784922.pdf?src-supplier=Arrow+Electronics; ComponentLink14URL: https://datasheet.octopart.com:443/ERJ-2RKF27R0X-Panasonic-datasheet-41391857.pdf?src-supplier=Electro+Sonic; ComponentLink14Description: https://datasheet.octopart.com:443/ERJ-2RKF27R0X-Panasonic-datasheet-41391857.pdf?src-supplier=Electro+Sonic
R57 = ERJ-2RKF33R0X: RES SMD 33 OHM 1% 1/10W 0402; Manufacturer: Panasonic; Power Rating: 100mW; Voltage Rating: 50V; Temperature Coefficient: 100ppm/°C; Supplier: Mouser; Supplier Part Number: 667-ERJ-2RKF33R0X; Manufacturer Part Number: ERJ-2RKF33R0X; RoHS: Yes; Category: Chip SMD Resistors; Stock: 1156222; Pricing: 1=0,1, 10=0,017, 50=0,017, 100=0,008, 1000=0,006, 10000=0,004 (USD); Mounting Technology: Surface Mount; Case/Package: 0402; Pins: 2; Case Code (Metric): 1005; Case Code (Imperial): 0402; Contact Plating: Tin; Min Operating Temperature: -55°C; Max Operating Temperature: 155°C; Tolerance: 1%; Packaging: Tape and Reel; Package Quantity: 1; Series: ERJ; Termination: SMD/SMT; Value: 33R; Resistor Type: Thick Film; Number of Terminations: 2; Max Power Dissipation: 100mW; Features: Automotive AEC-Q200; Resistance Tolerance: 1%; Voltage Rating (DC): 50V; Technology: THICK FILM; Construction: Rectangular; Length: 1mm; Width: 0.5mm; Height: 0.35mm; Depth: 0.5mm; RoHS Compliant: Yes; Reach SVHC Compliant: No; Lead Free: Lead Free; Military Standard: Not; ComponentLink1URL: https://datasheet.ciiva.com/11821/0900766b80f80784-11821292.pdf?src-supplier=Rs; ComponentLink1Description: https://datasheet.ciiva.com/11821/0900766b80f80784-11821292.pdf?src-supplier=Rs; ComponentLink2URL: https://datasheet.ciiva.com/5917/aoa0000ce2-5917817.pdf?src-supplier=Farnell; ComponentLink2Description: https://datasheet.ciiva.com/5917/aoa0000ce2-5917817.pdf?src-supplier=Farnell; ComponentLink3URL: https://datasheet.ciiva.com/7836/aoa0000ce2-7836490.pdf?src-supplier=Element14; ComponentLink3Description: https://datasheet.ciiva.com/7836/aoa0000ce2-7836490.pdf?src-supplier=Element14; ComponentLink4URL: https://datasheet.ciiva.com/7836/426256-7836813.pdf?src-supplier=Element14; ComponentLink4Description: https://datasheet.ciiva.com/7836/426256-7836813.pdf?src-supplier=Element14; ComponentLink5URL: https://datasheet.ciiva.com/43467/1678782-43467173.pdf?src-supplier=Farnell; ComponentLink5Description: https://datasheet.ciiva.com/43467/1678782-43467173.pdf?src-supplier=Farnell; ComponentLink6URL: https://datasheet.ciiva.com/46373/1678782-46373081.pdf?src-supplier=Element14; ComponentLink6Description: https://datasheet.ciiva.com/46373/1678782-46373081.pdf?src-supplier=Element14; ComponentLink7URL: https://datasheet.ciiva.com/46373/1678782-46373082.pdf?src-supplier=Element14; ComponentLink7Description: https://datasheet.ciiva.com/46373/1678782-46373082.pdf?src-supplier=Element14; ComponentLink8URL: https://datasheet.ciiva.com/24023/aoa0000ce2-24023999.pdf?src-supplier=Mouser; ComponentLink8Description: https://datasheet.ciiva.com/24023/aoa0000ce2-24023999.pdf?src-supplier=Mouser; ComponentLink9URL: https://datasheet.ciiva.com/16777/70260748-16777705.pdf?src-supplier=Allied+Electronics; ComponentLink9Description: https://datasheet.ciiva.com/16777/70260748-16777705.pdf?src-supplier=Allied+Electronics; ComponentLink10URL: https://datasheet.ciiva.com/9190/aoa0000ce2-9190507.pdf?src-supplier=Avnet; ComponentLink10Description: https://datasheet.ciiva.com/9190/aoa0000ce2-9190507.pdf?src-supplier=Avnet; Supplier 1: Mouser; Supplier Part Number 1: 667-ERJ-2RKF33R0X
R59 R62 R63 R74-R79 = ERJ-2RKF1001X: RES SMD 1K OHM 1% 1/10W 0402; Manufacturer: Panasonic Electronic Components; Power (Watts): 0.1W, 1/10W; Temperature Coefficient: ±100ppm/°C; Supplier 1: Digi-Key; Manufacturer Part Number: ERJ-2RKF1001X; RoHS: RoHS Compliant; Category: Resistors; Stock 1: 5504027; Pricing 1: 1=0.1, 10=0.025, 25=0.018, 50=0.0136, 100=0.01, 250=0.00764, 500=0.00612, 1000=0.00451, 5000=0.00323 (USD); Packaging: Digi-Reel®; Part Status: Active; Resistance (Ohms): 1k; Tolerance: ±1%; Composition: Thick Film; Features: Automotive AEC-Q200; Operating Temperature: -55°C ~ 155°C; Package / Case: 0402 (1005 Metric); Supplier Device Package: 0402; Size / Dimension: 0.039" L x 0.020" W (1.00mm x 0.50mm); Height - Seated (Max): 0.016" (0.40mm); Number of Terminations: 2; Failure Rate: -; ComponentLink1URL: https://industrial.panasonic.com/cdbs/www-data/pdf/RDA0000/AOA0000C283.pdf; ComponentLink1Description: https://industrial.panasonic.com/cdbs/www-data/pdf/RDA0000/AOA0000C283.pdf; Supplier Part Number 1: P1.00KLDKR-ND; Value: 1 k
R60 R61 = ERJ-2RKF5101X: RES SMD 5.1K OHM 1% 1/10W 0402; Manufacturer: Panasonic; Power Rating: 100mW; Voltage Rating: 50V; Temperature Coefficient: 100ppm/°C; Supplier: Mouser; Supplier Part Number: 667-ERJ-2RKF5101X; Manufacturer Part Number: ERJ-2RKF5101X; RoHS: Yes; Category: Chip SMD Resistors; Stock: 709989; Pricing: 1=0.1, 10=0.016, 50=0.016, 100=0.009, 1000=0.007, 10000=0.004 (USD); Mounting Technology: Surface Mount; Case/Package: 0402; Case Code (Imperial): 0402; Case Code (Metric): 1005; Weight: 2.8E-05oz; Contact Plating: Tin; Min Operating Temperature: -55°C; Max Operating Temperature: 155°C; Value: 5.1 k; Tolerance: 1%; Packaging: Tape and Reel; Package Quantity: 10000; Resistor Type: Thick Film; Termination: SMD/SMT; Number of Terminations: 2; Max Power Dissipation: 100mW; Series: ERJ; Resistance Tolerance: 1%; Technology: THICK FILM; Construction: Rectangular; Voltage Rating (DC): 50V; Length: 1mm; Width: 0.5mm; Height: 0.35mm; Depth: 0.5mm; Reach SVHC Compliant: No; Military Standard: Not; RoHS Compliant: Yes; Lead Free: 5697LeadFree; ComponentLink1URL: https://datasheet.ciiva.com/11821/0900766b80f80784-11821351.pdf?src-supplier=Rs; ComponentLink1Description: https://datasheet.ciiva.com/11821/0900766b80f80784-11821351.pdf?src-supplier=Rs; ComponentLink2URL: https://datasheet.ciiva.com/43467/1678782-43467375.pdf?src-supplier=Farnell; ComponentLink2Description: https://datasheet.ciiva.com/43467/1678782-43467375.pdf?src-supplier=Farnell; ComponentLink3URL: https://datasheet.ciiva.com/16761/70260748-16761739.pdf?src-supplier=Allied+Electronics; ComponentLink3Description: https://datasheet.ciiva.com/16761/70260748-16761739.pdf?src-supplier=Allied+Electronics; ComponentLink4URL: https://datasheet.ciiva.com/16788/70260748-16788554.pdf?src-supplier=Allied+Electronics; ComponentLink4Description: https://datasheet.ciiva.com/16788/70260748-16788554.pdf?src-supplier=Allied+Electronics; ComponentLink5URL: https://datasheet.ciiva.com/9195/aoa0000ce2-9195580.pdf?src-supplier=Avnet; ComponentLink5Description: https://datasheet.ciiva.com/9195/aoa0000ce2-9195580.pdf?src-supplier=Avnet; Supplier 1: Mouser; Supplier Part Number 1: 667-ERJ-2RKF5101X
R64-R67 = ERJ-2RKF1000X: RES SMD 100 OHM 1% 1/10W 0402; Manufacturer: Panasonic Electronic Components; Resistance (Ohms): 100; Power (Watts): 0.1W, 1/10W; Temperature Coefficient: ±100ppm/°C; Supplier 1: Digi-Key; Manufacturer Part Number: ERJ-2RKF1000X; RoHS: RoHS Compliant; Category: Resistors; Stock 1: 1714577; Pricing 1: 1=0.1, 10=0.025, 25=0.018, 50=0.0136, 100=0.01, 250=0.00764, 500=0.00612, 1000=0.00451, 5000=0.00323 (USD); Packaging: Digi-Reel®; Part Status: Active; Tolerance: ±1%; Composition: Thick Film; Features: Automotive AEC-Q200; Operating Temperature: -55°C ~ 155°C; Package / Case: 0402 (1005 Metric); Supplier Device Package: 0402; Size / Dimension: 0.039" L x 0.020" W (1.00mm x 0.50mm); Height - Seated (Max): 0.016" (0.40mm); Number of Terminations: 2; Failure Rate: -; ComponentLink1URL: https://industrial.panasonic.com/cdbs/www-data/pdf/RDA0000/AOA0000C283.pdf; ComponentLink1Description: https://industrial.panasonic.com/cdbs/www-data/pdf/RDA0000/AOA0000C283.pdf; Supplier Part Number 1: P100LDKR-ND; Value: 100 R
R68-R73 = ERJ-2RKF6200X: RES SMD 620 OHM 1% 1/10W 0402; Manufacturer: Panasonic; Voltage Rating: 50V; Resistance: 620R; Power Rating: 100mW; Temperature Coefficient: 100ppm/°C; Supplier 1: Digi-Key; Supplier Part Number 1: P620LCT-ND; Manufacturer Part Number: ERJ-2RKF6200X; Stock 1: 3402; Pricing 1: 1 = 0.10000, 10 = 0.04500, 100 = 0.01830, 1000 = 0.00823, 2500 = 0.00715, 5000 = 0.00590 (USD); RoHS: Yes; Mount: Surface Mount; Case/Package: 0402; Weight: 2.8E-05oz; Case Code (Metric): 1005; Case Code (Imperial): 0402; Contact Plating: Tin; Min Operating Temperature: -55°C; Max Operating Temperature: 155°C; Packaging: Tape and Reel; Tolerance: 1%; Package Quantity: 10000; Composition: Thick Film; Number of Terminations: 2; Termination: SMD/SMT; Max Power Dissipation: 100mW; Voltage Rating (DC): 50V; Features: Automotive AEC-Q200; Military Standard: Not; Length: 1mm; Height: 0.35mm; Width: 0.02inch; Depth: 0.5mm; REACH SVHC: No SVHC; Lead Free: Lead Free; ComponentLink1URL: https://datasheet.ciiva.com/11821/0900766b80f80784-11821345.pdf?src-supplier=RSComponents; ComponentLink1Description: https://datasheet.ciiva.com/11821/0900766b80f80784-11821345.pdf?src-supplier=RSComponents; ComponentLink2URL: https://datasheet.ciiva.com/46373/1678782-46373670.pdf?src-supplier=Element14; ComponentLink2Description: https://datasheet.ciiva.com/46373/1678782-46373670.pdf?src-supplier=Element14; ComponentLink3URL: https://datasheet.ciiva.com/46373/1678782-46373671.pdf?src-supplier=Element14; ComponentLink3Description: https://datasheet.ciiva.com/46373/1678782-46373671.pdf?src-supplier=Element14; ComponentLink4URL: https://datasheet.ciiva.com/22743/1678782-22743848.pdf?src-supplier=Farnell; ComponentLink4Description: https://datasheet.ciiva.com/22743/1678782-22743848.pdf?src-supplier=Farnell; ComponentLink5URL: https://datasheet.ciiva.com/7711/1678782-7711049.pdf?src-supplier=Element14; ComponentLink5Description: https://datasheet.ciiva.com/7711/1678782-7711049.pdf?src-supplier=Element14; ComponentLink6URL: https://datasheet.ciiva.com/16773/70260748-16773113.pdf?src-supplier=Allied+Electronics; ComponentLink6Description: https://datasheet.ciiva.com/16773/70260748-16773113.pdf?src-supplier=Allied+Electronics; ComponentLink7URL: https://datasheet.ciiva.com/30264/aoa0000ce2-30264139.pdf?src-supplier=Onlinecomponents.com; ComponentLink7Description: https://datasheet.ciiva.com/30264/aoa0000ce2-30264139.pdf?src-supplier=Onlinecomponents.com; ComponentLink8URL: https://datasheet.ciiva.com/22681/1678782-22681676.pdf?src-supplier=Element14; ComponentLink8Description: https://datasheet.ciiva.com/22681/1678782-22681676.pdf?src-supplier=Element14; ComponentLink9URL: https://datasheet.ciiva.com/43467/1678782-43467292.pdf?src-supplier=Farnell; ComponentLink9Description: https://datasheet.ciiva.com/43467/1678782-43467292.pdf?src-supplier=Farnell; ComponentLink10URL: https://datasheet.ciiva.com/24159/aoa0000ce2-24159919.pdf?src-supplier=Mouser; ComponentLink10Description: https://datasheet.ciiva.com/24159/aoa0000ce2-24159919.pdf?src-supplier=Mouser; ComponentLink11URL: https://datasheet.ciiva.com/28577/1694929-28577711.pdf?src-supplier=Element14; ComponentLink11Description: https://datasheet.ciiva.com/28577/1694929-28577711.pdf?src-supplier=Element14; Value: 620 R
SWD_RP50 UART_RP50 = SM03B-SRSS-TB(LF)(SN): Male Header, Pitch 1 mm, 1 x 3 Position, Height 2.9 mm, -25 to 85 degC, RoHS, Tape and Reel; Manufacturer: JST; Pitch: 1mm; Style/Orientation: RightAngleHeader/Plug; No of Positions: 3; Package Description: Male Header, Pitch 1 mm, 1 x 3 Position, Height 2.9 mm; Manufacturer URL: http://www.jst.com/home2.html; Package Reference: SM03B-SRSS-TB; Type: ShroudedHeader; Termination: Crimp; Mounting Technology: SurfaceMount; Datasheet Version: 11/2010; Datasheet URL: https://datasheet.ciiva.com/26894/getdatasheetpartid-708885-26894671.pdf; Supplier 1: Mouser; Supplier Part Number 1: 306-SM03BSRSSTBLFSNP
T50-T52 = CSD87502Q2: Transistor MOSFET Array Dual N-CH 30V 5A 6-Pin WSON T/R; Manufacturer: Texas Instruments; Manufacturer Lifecycle Status: ACTIVE; Drain to Source Resistance: 27mΩ; Gate to Source Voltage (Vgs): 20V; Input Capacitance: 353pF; Max Junction Temperature (Tj): 150°C; Max Power Dissipation: 2.3W; Number of Channels: 2; Rds On Max: 32.4mΩ; Turn-Off Delay Time: 12ns; Turn-On Delay Time: 3ns; Supplier: DigiKey; Supplier Part Number: 296-48123-1-ND; Manufacturer Part Number: CSD87502Q2; RoHS: Compliant; Category: MOSFETs; Stock: 34703; Pricing: 1=0.51, 10=0.36, 25=0.3216, 100=0.2796, 250=0.25944, 500=0.24728, 1000=0.2373 (USD); Continuous Drain Current (ID): 5A; Drain to Source Breakdown Voltage: 30V; Drain to Source Voltage (Vdss): 30V; Element Configuration: Dual; Height: 800µm; Lead Free: Lead Free; Length: 2mm; Lifecycle Status: Production; Max Operating Temperature: 150°C; Min Operating Temperature: -55°C; Mounting Technology: Surface Mount; Pins: 6; Packaging: Tape & Reel (TR); Power Dissipation: 2.3W; Thickness: 750µm; Width: 2mm; ComponentLink1URL: https://octopart.com:443/opatz8j6/c1?t=jYUYnSIbX3JPF1ppKMk94jqLtnau3o2NkWkpxZkVqshdsPn2Xnsvg0CJDB2kaMHx6WQztfzcG0OekiWwH8J70MlJcI-durRh-GJOHOOmtd0RYM7KAe0wYEmFuAjLdnVjgqQAc6gT_hdsjRctdgH-iPW_2Oueiud6o-NrKtiJndFloCa3B1i_RQfED1okSLG4Xw8I11rLNwbzJXAm6ZYaBzMeR__geF93AX8ENApcPsw-JHHu80pvtQpIKkben9NFycDOxZ9-SIDOejWvJQ5QoARsnRm2j0JEHlnaXI5po2wZZsSibe2fDTedVPkJBoOEn9-npMFdctWhFQ_C1ahfTUFKBVMfUu-NE6M6aEw9sB_0tPZyMRgjg1CcOD-TVVJMv-7K8DIbU7U&src-supplier=Texas+Instruments; ComponentLink1Description: https://octopart.com:443/opatz8j6/c1?t=jYUYnSIbX3JPF1ppKMk94jqLtnau3o2NkWkpxZkVqshdsPn2Xnsvg0CJDB2kaMHx6WQztfzcG0OekiWwH8J70MlJcI-durRh-GJOHOOmtd0RYM7KAe0wYEmFuAjLdnVjgqQAc6gT_hdsjRctdgH-iPW_2Oueiud6o-NrKtiJndFloCa3B1i_RQfED1okSLG4Xw8I11rLNwbzJXAm6ZYaBzMeR__geF93AX8ENApcPsw-JHHu80pvtQpIKkben9NFycDOxZ9-SIDOejWvJQ5QoARsnRm2j0JEHlnaXI5po2wZZsSibe2fDTedVPkJBoOEn9-npMFdctWhFQ_C1ahfTUFKBVMfUu-NE6M6aEw9sB_0tPZyMRgjg1CcOD-TVVJMv-7K8DIbU7U&src-supplier=Texas+Instruments; ComponentLink2URL: https://datasheet.octopart.com:443/CSD87502Q2-Texas-Instruments-datasheet-61500092.pdf?src-supplier=Texas+Instruments; ComponentLink2Description: https://datasheet.octopart.com:443/CSD87502Q2-Texas-Instruments-datasheet-61500092.pdf?src-supplier=Texas+Instruments; ComponentLink3URL: https://datasheet.octopart.com:443/CSD87502Q2-Texas-Instruments-datasheet-153476664.pdf?src-supplier=Augswan; ComponentLink3Description: https://datasheet.octopart.com:443/CSD87502Q2-Texas-Instruments-datasheet-153476664.pdf?src-supplier=Augswan; ComponentLink4URL: https://datasheet.octopart.com:443/CSD87502Q2-Texas-Instruments-datasheet-169738626.pdf?src-supplier=LCSC; ComponentLink4Description: https://datasheet.octopart.com:443/CSD87502Q2-Texas-Instruments-datasheet-169738626.pdf?src-supplier=LCSC; ComponentLink5URL: http://sigma.octopart.com:80/reach_statement/Texas-Instruments-company-64.pdf?src-supplier=Compliance+Statements; ComponentLink5Description: http://sigma.octopart.com:80/reach_statement/Texas-Instruments-company-64.pdf?src-supplier=Compliance+Statements; ComponentLink6URL: http://sigma.octopart.com:80/conflict_mineral_statement/Texas-Instruments-company-63.pdf?src-supplier=Compliance+Statements; ComponentLink6Description: http://sigma.octopart.com:80/conflict_mineral_statement/Texas-Instruments-company-63.pdf?src-supplier=Compliance+Statements; Supplier 1: DigiKey; Supplier Part Number 1: 296-48123-1-ND
U50 = FPF1320UCX: IC ADVANCED POWER SWITCH 6WLCSP; Manufacturer: Fairchild Semiconductor; Number of Outputs: 1; Rds (On): 60 mOhm; Internal Switch(s): Yes; Current Limit: 1.5A; Voltage - Input: 1.5 V ~ 5.5 V; Supplier 1: Digi-Key; Manufacturer Part Number: FPF1320UCX; RoHS: RoHS Compliant; Category: Integrated Circuits (ICs); Stock 1: 1622; Pricing 1: 1=0.73, 10=0.636, 25=0.562, 100=0.4896, 250=0.42616, 500=0.36278, 1000=0.29057 (EUR); Packaging: Digi-Reel®; Type: High Side Switch; Operating Temperature: -40°C ~ 85°C; Mounting Type: Surface Mount; Package / Case: 6-UFBGA, WLCSP; Supplier Device Package: 6-WLCSP; ComponentLink1URL: http://www.fairchildsemi.com/ds/FP/FPF1320.pdf; ComponentLink1Description: http://www.fairchildsemi.com/ds/FP/FPF1320.pdf; Supplier Part Number 1: FPF1320UCXDKR-ND
U51 = TPS62840YBGR: Conv DC-DC 1.8V to 6.5V Synchronous Step Down Single-Out 1.8V to 3.3V 0.75A 6-Pin DSBGA T/R; Manufacturer: Texas Instruments; Supplier: Mouser; Supplier Part Number: 595-TPS62840YBGR; Manufacturer Part Number: TPS62840YBGR; RoHS: Yes; Category: Voltage Regulators - Switching; Stock: 2271; Pricing: 1=1,97, 10=1,77, 50=1,77, 100=1,42, 1000=0,972, 10000=0,865 (USD); Supplier 1: Mouser; Supplier Part Number 1: 595-TPS62840YBGR